# EAGLE board Main board (EAGLE 9.5.2)
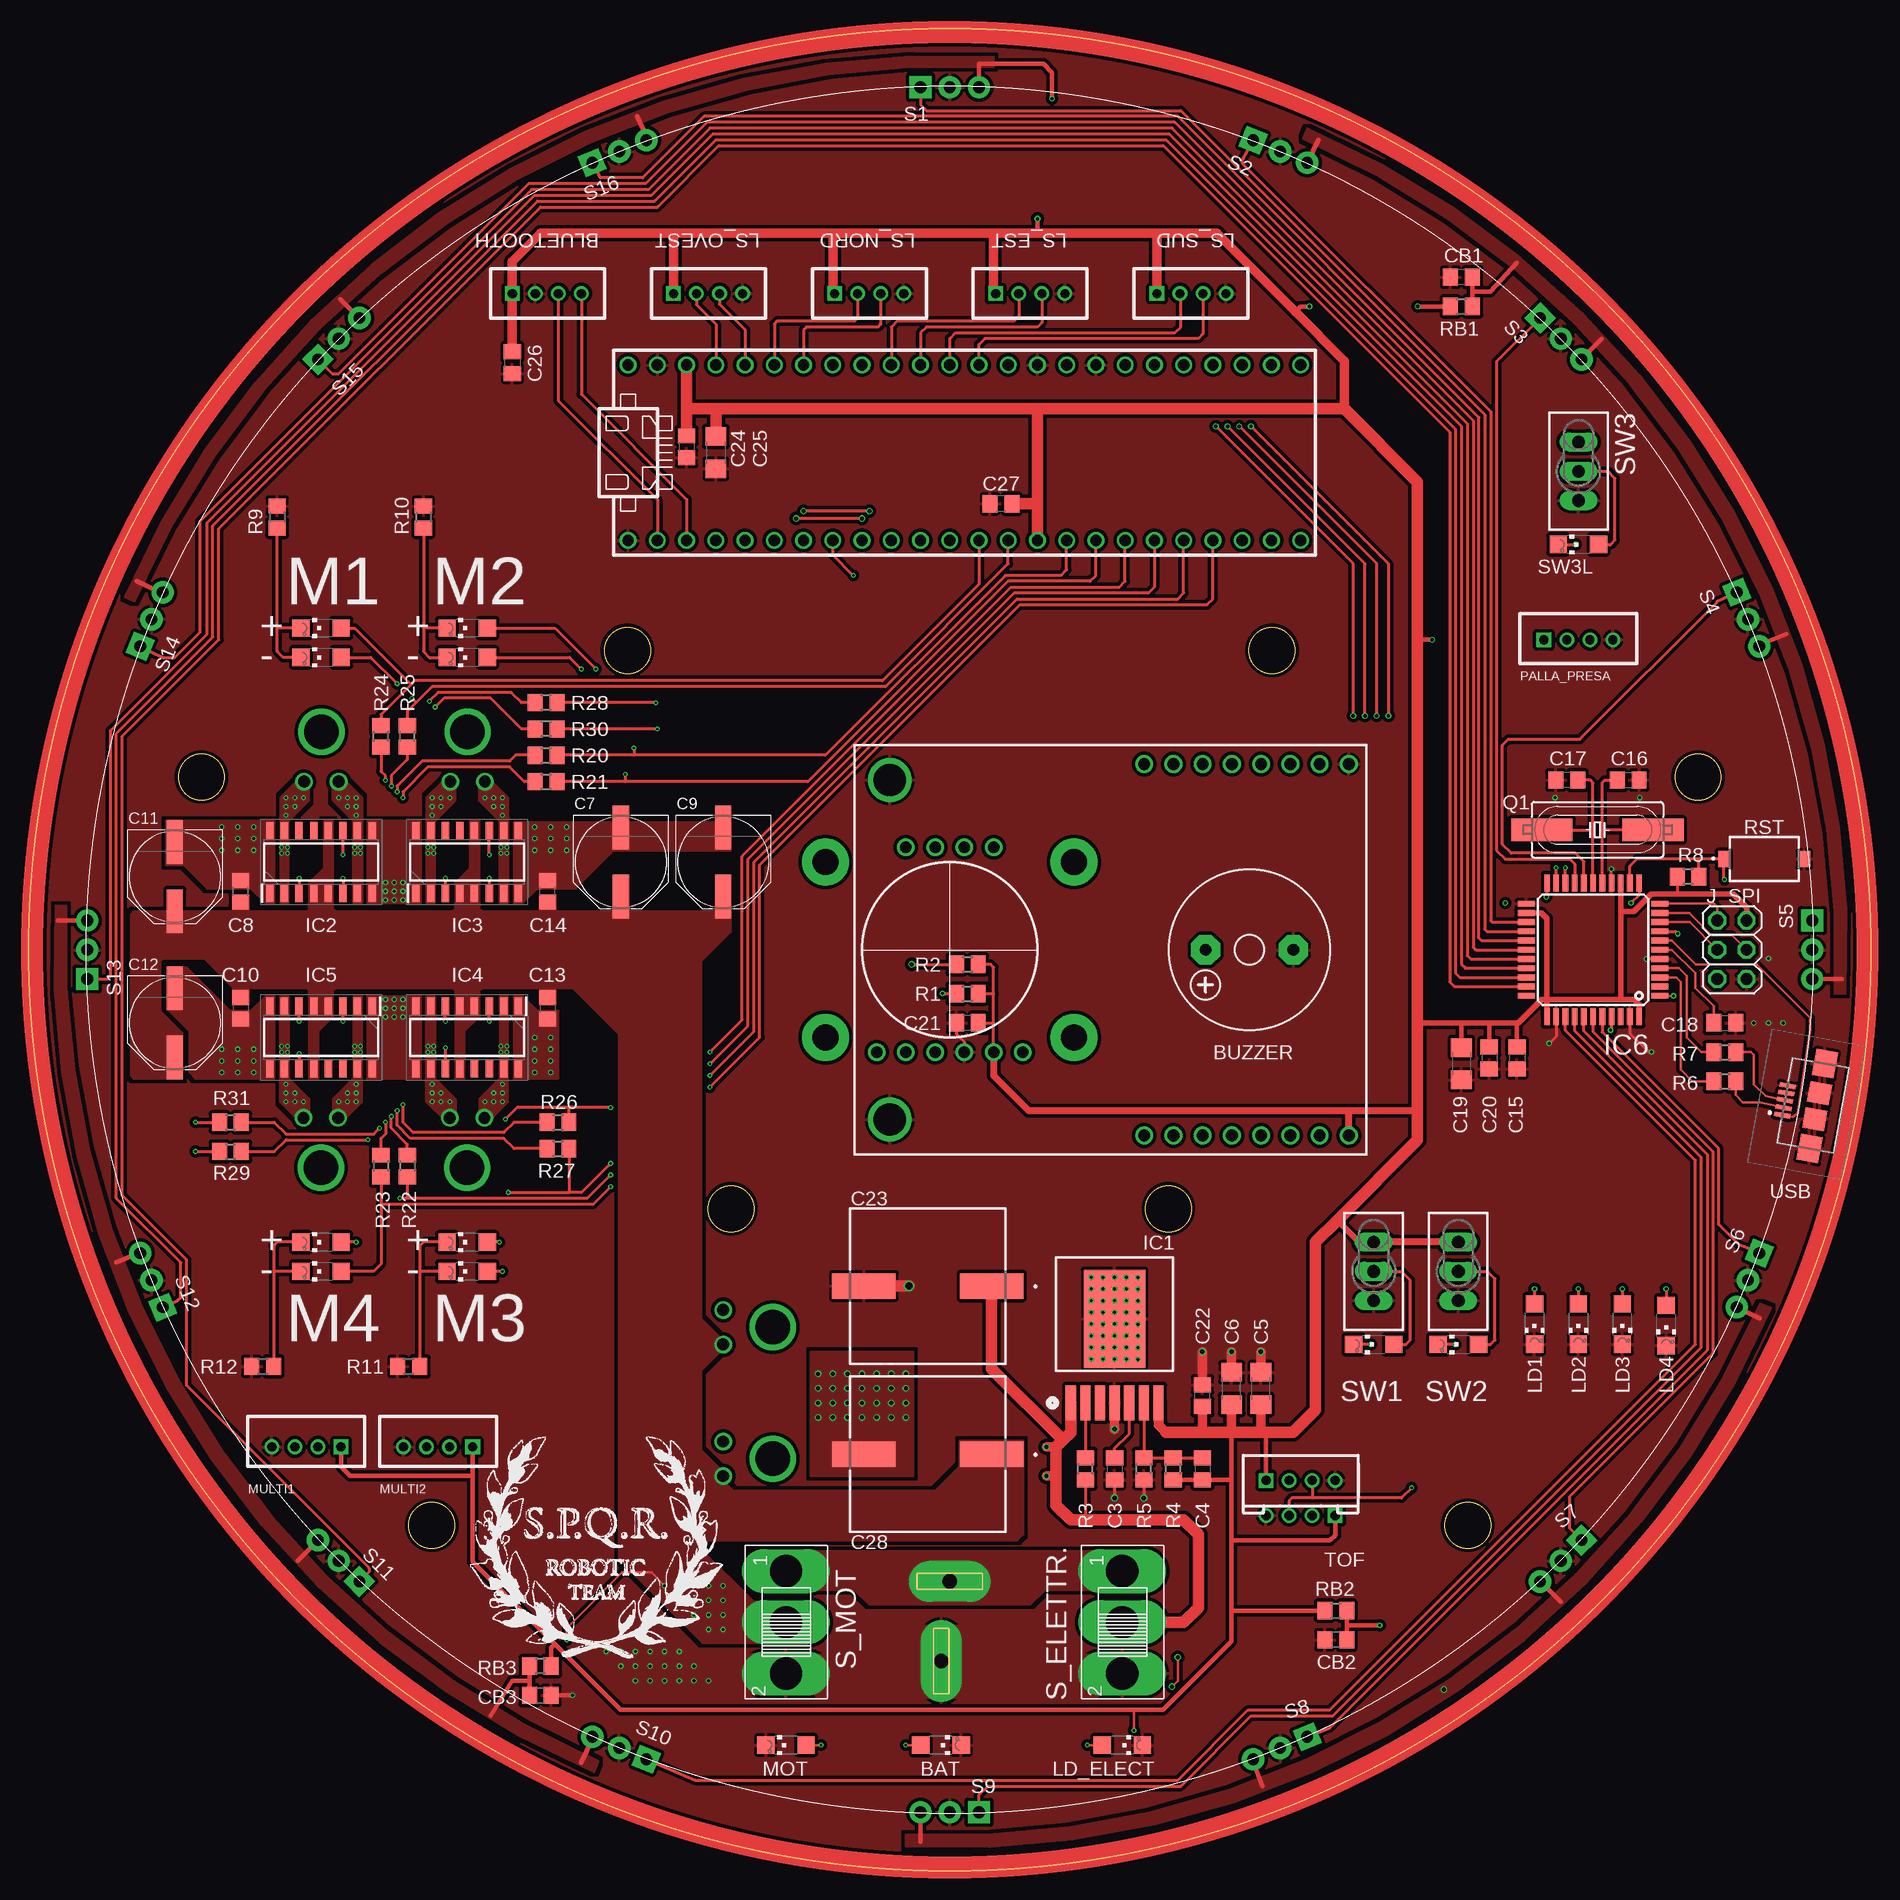
[diagram p1: board, top side]
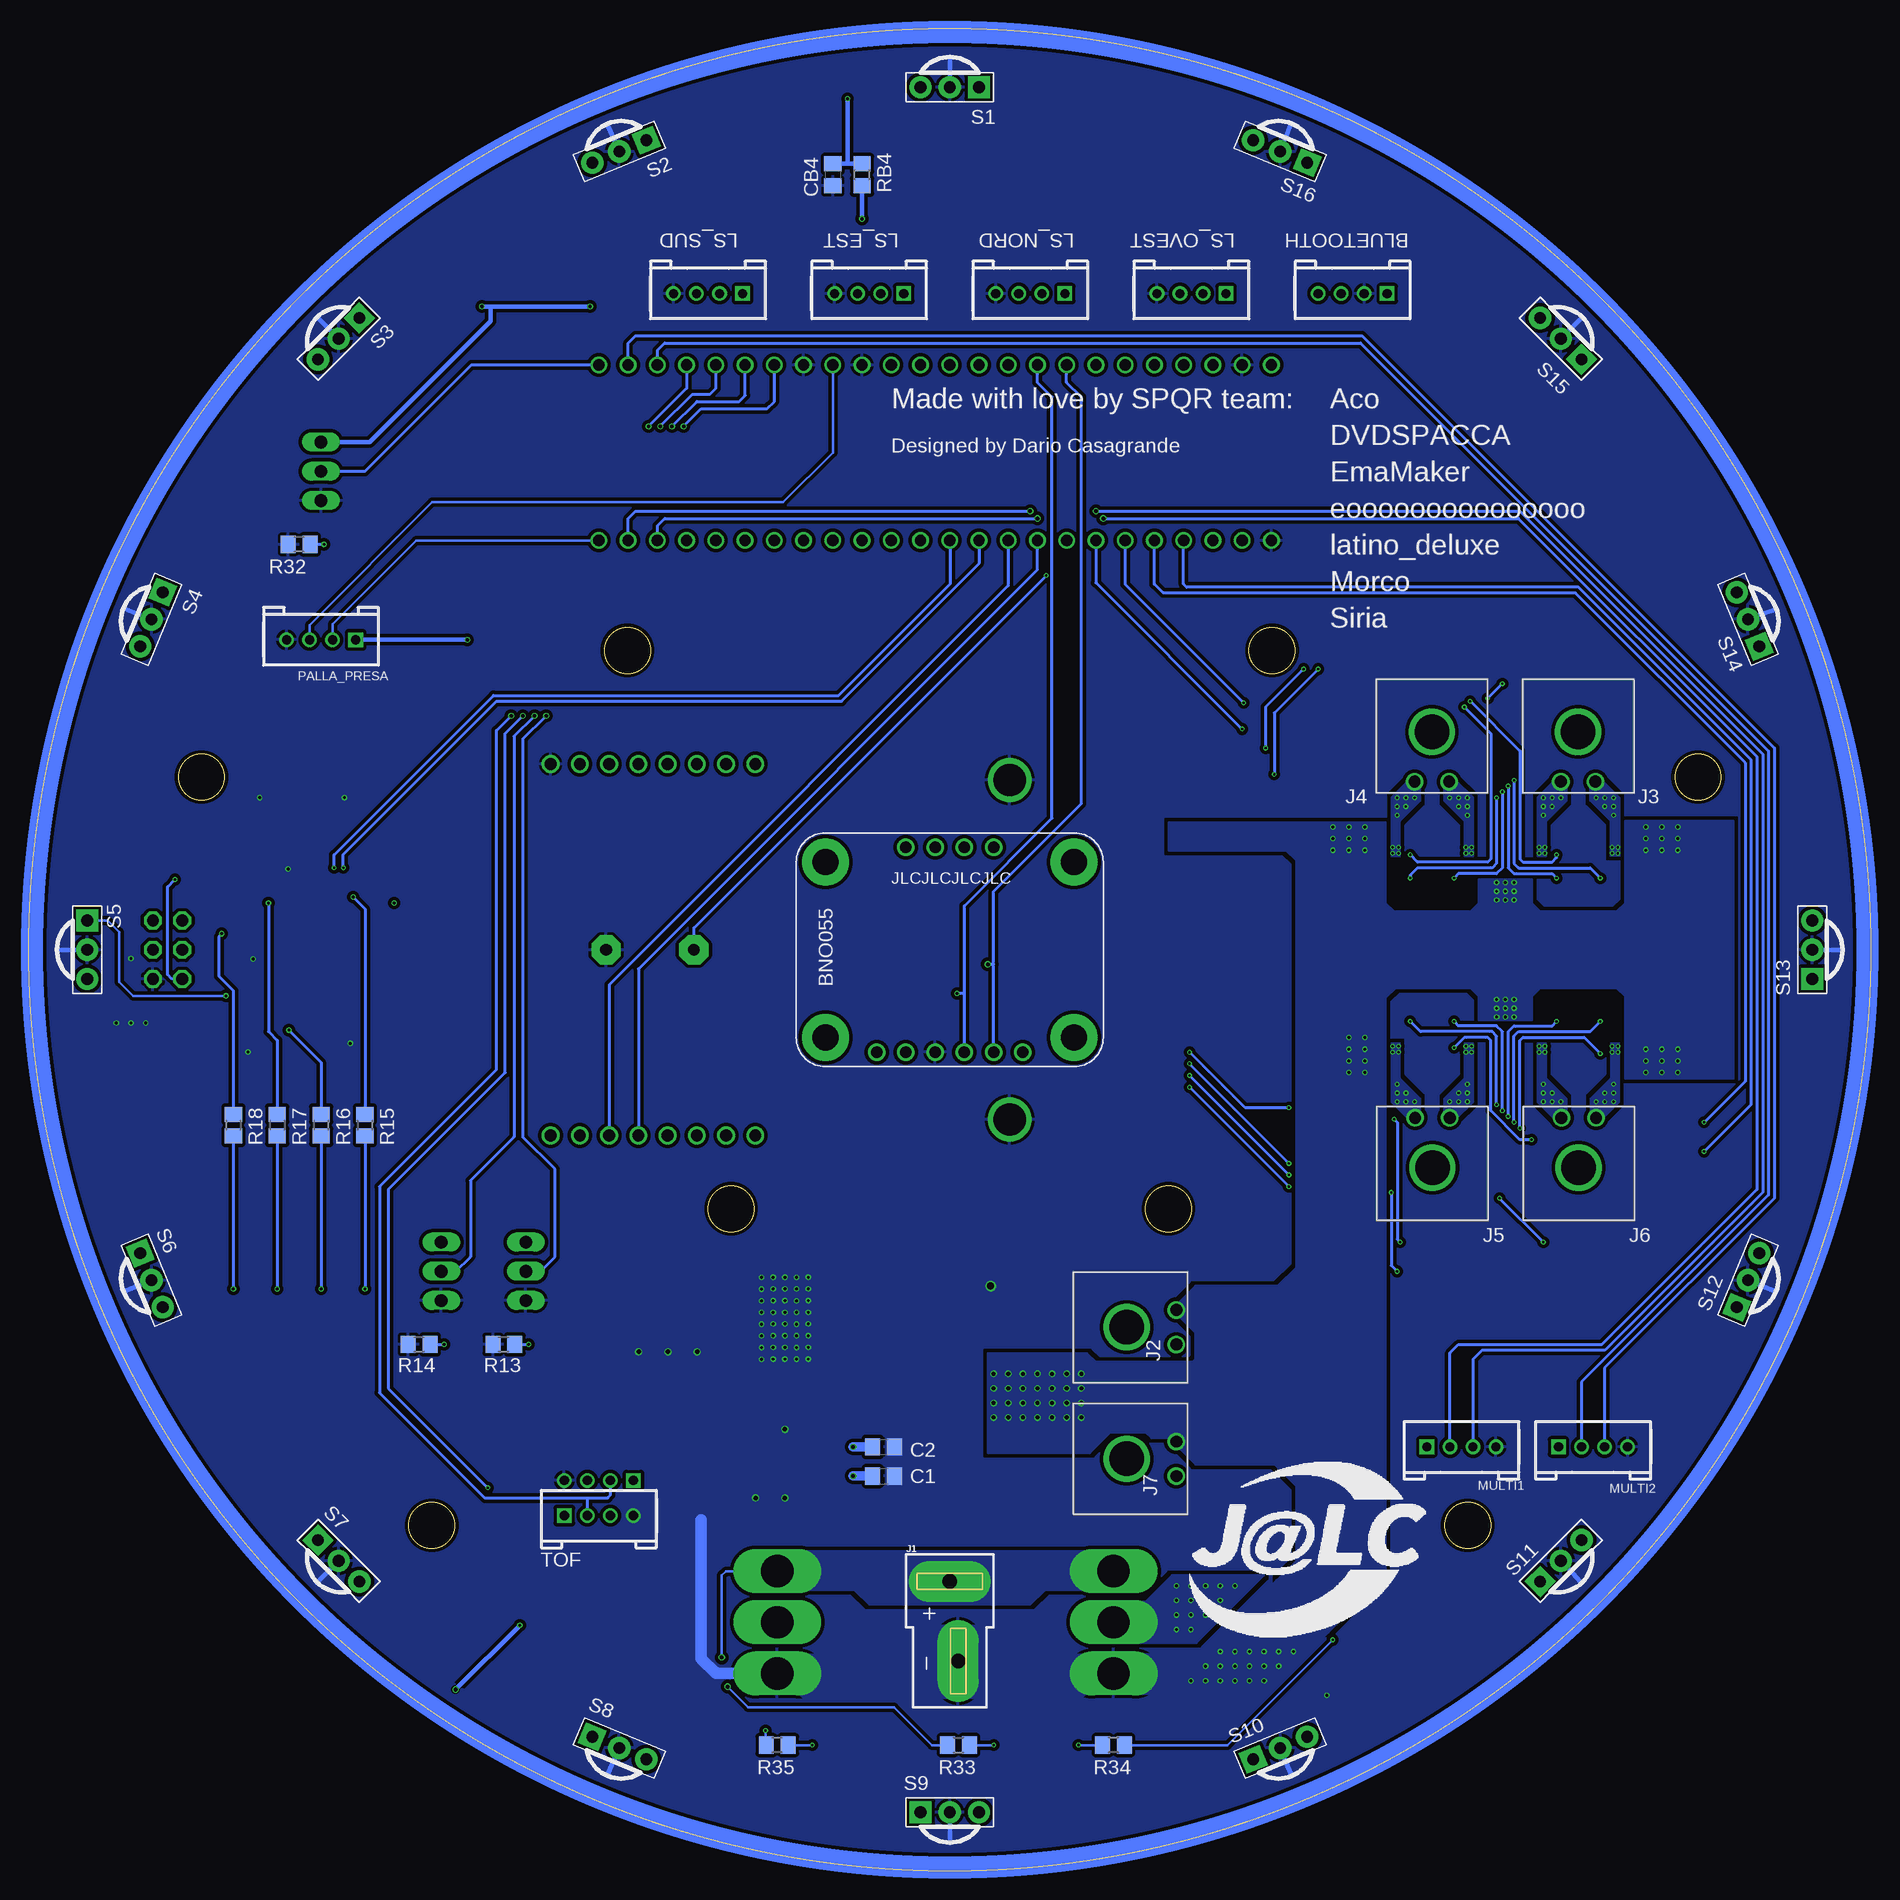
[diagram p2: board, bottom side, seen from below]

Size 160 x 160 mm. Coordinates in mm from the lower left corner, seen from the top.
Outline: circle at 80,80 radius 80
Outline: circle at 61,57.5 radius 2
Outline: circle at 99,57.5 radius 2
Outline: circle at 52,106 radius 2
Outline: circle at 108,106 radius 2
Outline: circle at 125,30 radius 2
Outline: circle at 35,30 radius 2
Outline: circle at 15,95 radius 2
Outline: circle at 145,95 radius 2
Copper layers (1*16): Top 0.035mm / dielectric 0.2mm / Bottom 0.035mm
Design rules "JLCPCB - 2 layers": minimum track width 3.5mil, minimum drill 0.2mm, track to track 3.5mil, track to pad 5mil, pad to pad 5mil, via to via 5mil, smd to smd 0mil, copper to edge 0.1mm, drill to drill 5mil, minimum pad ring 4mil, minimum via ring 4mil, stop-mask expansion 3mil, vias tented up to drill 100mil, thermal gap 10mil
Net classes: 1 Power: width 0.305 mm, clearance 0.305 mm; 2 +5V/1: width 0.61 mm, drill 0.406 mm, clearance 0.457 mm

## Footprints (pad centres in the part's own frame; a part is rotated, then mirrored left to right if it is on the bottom)
2.0_1X4 = drill 0.8 pad 1.27 square: 1 -3,0 | drill 0.8 pad 1.27: 2 -1,0; 3 1,0; 4 3,0
CHIPLED_1206 = smd 1.5 x 1.5: A 0,-1.75; C 0,1.75
F/CM12P = drill 1.016 pad 2.54 octagon: + 3.81,0; - -3.81,0
C0805 = smd 1.3 x 1.5: 1 -0.95,0; 2 0.95,0
C1206 = smd 1.6 x 1.8: 1 -1.4,0; 2 1.4,0
PANASONIC_E = smd 3.8 x 1.4: + 3,0; - -3,0
FKV(H13) = smd 5.5 x 2.2: 1 -5.55,0; 2 5.55,0
NDW0007A = smd 0.89 x 3.06: 1 -3.81,0; 2 -2.54,0; 3 -1.27,0; 4 0,0; 5 1.27,0; 6 2.54,0; 7 3.81,0 | smd 5.35 x 8.54: 8 0,7.305
SOIC127P600X175-16N = smd 1.525 x 0.65: 1 -2.712,4.445; 2 -2.712,3.175; 3 -2.712,1.905; 4 -2.712,0.635; 5 -2.712,-0.635; 6 -2.712,-1.905; 7 -2.712,-3.175; 8 -2.712,-4.445; 9 2.712,-4.445; 10 2.712,-3.175; 11 2.712,-1.905; 12 2.712,-0.635; 13 2.712,0.635; 14 2.712,1.905; 15 2.712,3.175; 16 2.712,4.445
TQFP44 = smd 1.5 x 0.5: 1 -5.8,4; 2 -5.8,3.2; 3 -5.8,2.4; 4 -5.8,1.6; 5 -5.8,0.8; 6 -5.8,0; 7 -5.8,-0.8; 8 -5.8,-1.6; 9 -5.8,-2.4; 10 -5.8,-3.2; 11 -5.8,-4; 23 5.8,-4; 24 5.8,-3.2; 25 5.8,-2.4; 26 5.8,-1.6; 27 5.8,-0.8; 28 5.8,0; 29 5.8,0.8; 30 5.8,1.6; 31 5.8,2.4; 32 5.8,3.2; 33 5.8,4 | smd 0.5 x 1.5: 12 -4,-5.8; 13 -3.2,-5.8; 14 -2.4,-5.8; 15 -1.6,-5.8; 16 -0.8,-5.8; 17 0,-5.8; 18 0.8,-5.8; 19 1.6,-5.8; 20 2.4,-5.8; 21 3.2,-5.8; 22 4,-5.8; 34 4,5.8; 35 3.2,5.8; 36 2.4,5.8; 37 1.6,5.8; 38 0.8,5.8; 39 0,5.8; 40 -0.8,5.8; 41 -1.6,5.8; 42 -2.4,5.8; 43 -3.2,5.8; 44 -4,5.8
DEANS = drill 1.27 pad 3.556 long: + 0,0; - 0.737,-6.921
43650-0200 = drill 1.02 pad 1.52: 1 0,0; 2 -3,0 | drill 3 pad 3: 3 -1.5,-4.32
2X03 = drill 1.016 octagon: 1 -2.54,-1.27; 2 -2.54,1.27; 3 0,-1.27; 4 0,1.27; 5 2.54,-1.27; 6 2.54,1.27
HC49UP = smd 5.334 x 1.93: 1 -4.826,0; 2 4.826,0
R0805 = smd 1.3 x 1.5: 1 -0.95,0; 2 0.95,0
KSR = smd 1 x 1.4: 1 -3.5,0; 2 3.5,0
PNA460XM = drill 1.016 pad 1.93 square: 1 -2.54,0 | drill 1.016 pad 1.93: 2 0,0; 3 2.54,0
255SB = drill 2.8 pad 3.048 long: 1 2.667,3.556; 2 7.112,3.556; 3 11.557,3.556
TL3XPO = drill 1.1 pad 1.422 long: 1 -2.54,0; 2 0,0; 3 2.54,0
TEENSY_3.5/3.6 = drill 0.965: 0/RX -25.4,-7.62; 1/TX -22.86,-7.62; 2 -20.32,-7.62; 3/CANTX -17.78,-7.62; 3V3 7.62,-7.62; 3V3_LO -22.86,7.62; 4/CANRX -15.24,-7.62; 5 -12.7,-7.62; 6 -10.16,-7.62; 7 -7.62,-7.62; 8 -5.08,-7.62; 9/CS -2.54,-7.62; 10/CS 0,-7.62; 11/MOSI 2.54,-7.62; 12/MISO 5.08,-7.62; 13/SCK 5.08,7.62; 14/A0 2.54,7.62; 15/A1 0,7.62; 16/A2 -2.54,7.62; 17/A3 -5.08,7.62; 18/A4/SDA -7.62,7.62; 19/A5/SCL -10.16,7.62; 20/A6 -12.7,7.62; 21/A7 -15.24,7.62; 21/DAC0 12.7,7.62; 22/A8 -17.78,7.62; 23/A9 -20.32,7.62; 24 10.16,-7.62; 25 12.7,-7.62; 26 15.24,-7.62; 27 17.78,-7.62; 28 20.32,-7.62; 29 22.86,-7.62; 30 25.4,-7.62; 31/A12 27.94,-7.62; 32/A13 30.48,-7.62; 33/A14 30.48,7.62; 34/A15 27.94,7.62; 35/A16 25.4,7.62; 36/A17 22.86,7.62; 37/A18 20.32,7.62; 38/A19 17.78,7.62; 39/A20 15.24,7.62; A22/DAC1 10.16,7.62; AGND -25.4,7.62; GND -27.94,-7.62; GND2 7.62,7.62; VIN -27.94,7.62
OPENMV_H7 = drill 1.016: 3V3 1.651,1.524; BOOT 33.909,16.764; GND 33.909,1.524; P0 1.651,19.304; P1 1.651,16.764; P2 1.651,14.224; P3 1.651,11.684; P4 1.651,9.144; P5 1.651,6.604; P6 1.651,4.064; P7 33.909,6.604; P8 33.909,9.144; P9 33.909,11.684; RST 33.909,19.304; SYNC 33.909,14.224; VIN 33.909,4.064 | drill 2.794 pad 3.81: PAD1 3.048,41.402 | drill 2.794: PAD2 32.512,41.402
BNO055 = drill 1: 3V3 9.525,1.27; ADR 17.145,19.05; GND 12.065,1.27; INT 14.605,19.05; PS0 9.525,19.05; PS1 12.065,19.05; RST 19.685,1.27; SCL 17.145,1.27; SDA 14.605,1.27; VIN 6.985,1.27 | drill 2.286 pad 4.064: PAD@1 2.54,17.78; PAD@2 24.13,17.78; PAD@3 2.54,2.54; PAD@4 24.13,2.54
101041110001LF = smd 0.4 x 1.4: 1 -1.3,5; 2 -0.65,5; 3 0,5; 4 0.65,5; 5 1.3,5 | smd 2.3 x 1.9: 6 -3.75,2.15; 7 3.75,2.15 | smd 1.8 x 1.9: 8 -1.15,2.15; 9 1.15,2.15

## Placement (x,y rotation side)
BALL  TWIG_2.0  [2.0_1X4]  134.61,106.92 180 bottom
BAT  [CHIPLED_1206]  79.24,10.91 270 top
BLUETOOTH  TWIG_2.0  [2.0_1X4]  45,137 180 bottom
BUZZER  F/CM12P  [F/CM12P]  106.03,80 180 top
C1  100n  [C0805]  85.75,34.28 0 bottom
C2  100n  [C0805]  85.75,36.82 0 bottom
C3  22n  [C0805]  94.32,34.91 270 top
C4  22n  [C0805]  101.94,34.91 270 top
C5  100u  [C1206]  107.02,41.9 90 top
C6  100u  [C1206]  104.48,41.9 90 top
C7  1OOu  [PANASONIC_E]  51.42,87.62 270 top
C8  1u  [C0805]  18.41,85.08 90 top
C9  100u  [PANASONIC_E]  60.31,87.62 270 top
C10  1u  [C0805]  18.41,74.92 270 top
C11  100u  [PANASONIC_E]  12.69,86.35 270 top
C12  100u  [PANASONIC_E]  12.69,73.65 270 top
C13  1u  [C0805]  45.08,74.92 270 top
C14  1u  [C0805]  45.08,85.08 90 top
C15  1u  [C0805]  129.28,70.6 270 top
C16  1u  [C0805]  138.93,94.73 0 top
C17  1u  [C0805]  133.59,94.73 180 top
C18  1u  [C0805]  147.31,73.65 0 top
C19  1u  [C1206]  124.45,70.09 270 top
C20  1u  [C0805]  126.86,70.6 270 top
C21  1u  [C0805]  81.52,73.65 180 top
C22  100n  [C0805]  101.94,41.27 90 top
C23  EEV-FK1C152Q  [FKV(H13)]  78.09,50.79 180 top
C24  100n  [C0805]  57.14,123.69 270 top
C25  100n  [C1206]  59.68,123.18 270 top
C26  1u  [C0805]  42,131 270 top
C27  100n  [C0805]  84.44,118.73 180 top
C28  EEV-FK1C152Q  [FKV(H13)]  78.09,36.19 180 top
CB1  0.1uF  [C0805]  124.45,138.42 180 top
CB2  0.1uF  [C0805]  113.53,20.06 180 top
CB3  0.1uF  [C0805]  44.44,15.23 0 top
CB4  0.1uF  [C0805]  90.16,147.31 270 bottom
IC1  LMZ14202TZE-ADJ_NOPB  [NDW0007A]  94.32,40.63 0 top
IC2  VNH7070ASTR  [SOIC127P600X175-16N]  25.39,87.62 90 top
IC3  VNH7070ASTR  [SOIC127P600X175-16N]  38.09,87.62 90 top
IC4  VNH7070ASTR  [SOIC127P600X175-16N]  38.09,72.38 270 top
IC5  VNH7070ASTR  [SOIC127P600X175-16N]  25.39,72.38 270 top
IC6  ATMEGA32U4-AU  [TQFP44]  135.88,80 180 top
J1  [DEANS]  80,25.14 0 bottom
J2  43650-0201  [43650-0200]  60.31,45.71 270 bottom
J3  43650-0201  [43650-0200]  26.91,94.61 180 bottom
J4  43650-0201  [43650-0200]  39.61,94.61 180 bottom
J5  43650-0201  [43650-0200]  36.57,65.39 0 bottom
J6  43650-0201  [43650-0200]  23.87,65.39 0 bottom
J7  43650-0201  [43650-0200]  60.31,34.28 270 bottom
J_SPI  [2X03]  147.94,80 270 top
LD1  [CHIPLED_1206]  130.8,47.49 180 top
LD2  [CHIPLED_1206]  134.61,47.49 180 top
LD3  [CHIPLED_1206]  138.42,47.49 180 top
LD4  [CHIPLED_1206]  142.23,47.36 180 top
LD_ELECT  [CHIPLED_1206]  94.99,10.91 270 top
LS_EST  TWIG_2.0  [2.0_1X4]  87,137 180 bottom
LS_NORD  TWIG_2.0  [2.0_1X4]  73,137 180 bottom
LS_OVEST  TWIG_2.0  [2.0_1X4]  59,137 180 bottom
LS_SUD  TWIG_2.0  [2.0_1X4]  101,137 180 bottom
M1+  [CHIPLED_1206]  25.39,107.94 90 top
M1-  [CHIPLED_1206]  25.39,105.4 90 top
M2+  [CHIPLED_1206]  38.09,107.94 90 top
M2-  [CHIPLED_1206]  38.09,105.4 90 top
M3+  [CHIPLED_1206]  38.09,54.6 90 top
M3-  [CHIPLED_1206]  38.09,52.06 90 top
M4+  [CHIPLED_1206]  25.39,54.6 90 top
M4-  [CHIPLED_1206]  25.39,52.06 90 top
MOT  [CHIPLED_1206]  65.78,10.91 90 top
MULTI1  TWIG_2.0  [2.0_1X4]  35.55,36.82 0 bottom
MULTI2  TWIG_2.0  [2.0_1X4]  24.12,36.82 0 bottom
Q1  [HC49UP]  136.26,90.41 180 top
R1  10k  [R0805]  81.52,76.19 0 top
R2  10k  [R0805]  81.52,78.73 0 top
R3  61,9k  [R0805]  91.78,34.91 90 top
R4  3,32k  [R0805]  99.4,34.91 90 top
R5  1,07k  [R0805]  96.86,34.91 90 top
R6  [R0805]  147.31,68.57 0 top
R7  [R0805]  147.31,71.11 0 top
R8  [R0805]  144.13,86.35 180 top
R9  [R0805]  21.58,117.59 270 top
R10  [R0805]  34.28,117.59 270 top
R11  [R0805]  33.01,43.8 0 top
R12  [R0805]  20.31,43.8 0 top
R13  [R0805]  118.73,45.71 180 bottom
R14  [R0805]  126.09,45.71 180 bottom
R15  [R0805]  130.8,64.76 270 bottom
R16  [R0805]  134.61,64.76 270 bottom
R17  [R0805]  138.42,64.76 270 bottom
R18  [R0805]  142.23,64.76 270 bottom
R20  [R0805]  44.95,96.89 0 top
R21  [R0805]  44.95,94.61 0 top
R22  [R0805]  32.88,61.2 270 top
R23  [R0805]  30.6,61.2 270 top
R24  [R0805]  30.6,98.54 90 top
R25  [R0805]  32.88,98.54 90 top
R26  [R0805]  45.96,65.01 0 top
R27  [R0805]  45.96,62.73 0 top
R28  [R0805]  44.95,101.46 180 top
R29  [R0805]  17.52,62.47 0 top
R30  [R0805]  44.95,99.18 180 top
R31  [R0805]  17.52,65.01 0 top
R32  [R0805]  136.51,115.21 180 bottom
R33  [R0805]  79.24,10.91 0 bottom
R34  [R0805]  65.78,10.91 180 bottom
R35  [R0805]  94.99,10.91 180 bottom
RB1  22  [R0805]  124.45,135.88 0 top
RB2  22  [R0805]  113.53,22.6 0 top
RB3  22  [R0805]  44.44,17.77 180 top
RB4  22  [R0805]  87.62,147.31 90 bottom
RST  KSR231GLFS  [KSR]  150.74,87.87 0 top
S1  PNA460XM  [PNA460XM]  80,154.93 180 bottom
S2  PNA460XM  [PNA460XM]  108.7,149.34 202.5 bottom
S3  PNA460XM  [PNA460XM]  133.09,133.09 225 bottom
S4  PNA460XM  [PNA460XM]  149.34,108.7 247.5 bottom
S5  PNA460XM  [PNA460XM]  154.93,80 270 bottom
S6  PNA460XM  [PNA460XM]  149.34,51.3 292.5 bottom
S7  PNA460XM  [PNA460XM]  133.09,26.91 315 bottom
S8  PNA460XM  [PNA460XM]  108.7,10.66 337.5 bottom
S9  PNA460XM  [PNA460XM]  80,5.07 0 bottom
S10  PNA460XM  [PNA460XM]  51.3,10.66 22.5 bottom
S11  PNA460XM  [PNA460XM]  26.91,26.91 45 bottom
S12  PNA460XM  [PNA460XM]  10.66,51.3 67.5 bottom
S13  PNA460XM  [PNA460XM]  5.07,80 90 bottom
S14  PNA460XM  [PNA460XM]  10.66,108.7 112.5 bottom
S15  PNA460XM  [PNA460XM]  26.91,133.09 135 bottom
S16  PNA460XM  [PNA460XM]  51.3,149.34 157.5 bottom
S_ELETTR.  [255SB]  91.43,28.69 270 top
S_MOT  [255SB]  62.22,28.69 270 top
SW1  TL38PO  [TL3XPO]  116.83,52.06 270 top
SW1L  [CHIPLED_1206]  116.83,45.71 90 top
SW2  TL38PO  [TL3XPO]  124.18,52.06 270 top
SW2L  [CHIPLED_1206]  124.18,45.71 90 top
SW3  TL38PO  [TL3XPO]  134.61,121.56 270 top
SW3L  [CHIPLED_1206]  134.61,115.21 90 top
TOF  TWIG_2.0  [2.0_1X4]  110.48,30.85 0 bottom
TOF_TOP  TWIG_2.0  [2.0_1X4]  110.48,33.9 0 top
U$1  TEENSY_3.5/3.6  [TEENSY_3.5/3.6]  80,123.18 0 top
U$2  OPENMV_H7  [OPENMV_H7]  116.19,62.22 90 top
U$4  BNO055  [BNO055]  93.34,69.84 0 bottom
USB  10104111-0001LF  [101041110001LF]  157.47,66.03 79.7 top

## Tracks (layer width: path | path; a pad name or v marks a point on that pad's centre or on a via)
+3V3  (via drill 0.2, 0.3)
  Top 0.203: 96,13.96 v96,12.18
  Top 0.254: U$4.3V3 83.81,73.65 | 83.81,73.65 83.81,76.19 | 83.81,76.19 83.81,78.48 83.56,78.73 R2.2 | R1.2 83.81,76.19 | C21.1 83.81,73.65 | R8.2 143.19,84.89 143.25,84.83
  Top 0.406: 138.28,75.69 138.29,75.68 | 45.71,19.67 51.42,13.96 96,13.96 98.51,13.96 104.48,19.93 104.48,22.6 | RB1.1 v120.64,135.88 | C19.1 124.45,73.65 | C15.1 129.28,73.65 | v111.24,135.88 110.48,135.88 110.02,135.42 | v87.62,143.5 87.62,142.23 | C20.1 126.86,73.52 126.74,73.65 | MULTI2.1 27.12,35.09 27.93,34.28 38.55,34.28 | MULTI1.1 38.55,34.28 | 38.55,34.28 38.55,26.84 45.71,19.67 | RB3.1 45.39,19.35 45.71,19.67 | v121.91,106.92 120.64,106.92 | TOF.1 113.48,29.15 113.02,28.69 104.48,28.69 | 104.48,28.69 104.48,34.03 | 104.48,34.03 104.48,38.09 | 104.48,22.6 104.48,28.69 | RB2.1 104.48,22.6 | R4.1 C4.2 104.42,33.97 104.48,34.03 | TOF_TOP.1 107.48,38.04 107.43,38.09
  Top 0.457: IC6.24 131.41,83.2 131.88,82.73 131.88,75.68 | 131.88,75.68 IC6.34 | IC6.44 139.88,75.24 139.44,75.68 138.29,75.68 131.88,75.68 | IC6.14 138.28,83.3 | 138.28,83.3 138.28,75.69 | J_SPI.2 149.22,83.68 148.07,84.83 143.25,84.83 140.96,84.83 139.44,83.3 138.28,83.3 | 131.88,75.68 131.44,75.68 129.4,73.65 129.28,73.65 126.74,73.65 124.45,73.65 120.64,73.65
  Top 0.508: SW1.1 115.56,54.6 113.66,56.5
  Top 0.61: U$4.3V3 83.81,69.08 86.86,66.03 114.67,66.03 | 114.67,66.03 120.64,66.03 | U$2.3V3 114.67,66.03 | SW2.1 SW1.1
  Top 0.813: C22.1 101.94,38.09 | C6.1 104.48,38.09 | C5.1 107.02,38.09 | C26.1 BLUETOOTH.1 42,139.79 44.44,142.23 55.87,142.23 | 114.29,126.99 114.29,131.15 110.02,135.42 103.21,142.23 97.78,142.23 | 55.87,142.23 69.84,142.23 | 69.84,142.23 83.81,142.23 | 83.81,142.23 87.62,142.23 97.78,142.23 | LS_NORD.1 69.84,137.16 69.84,142.23 | LS_EST.1 83.81,137.19 83.81,142.23 | LS_SUD.1 98,142.01 97.78,142.23 | LS_OVEST.1 56,142.1 55.87,142.23
  Top 0.889: IC1.7 98.13,38.73 98.77,38.09
  Top 1.016: 98.77,38.09 101.94,38.09 104.48,38.09 107.02,38.09 107.43,38.09 109.83,38.09 111.75,40.01 111.75,54.6 113.66,56.5 120.64,63.49 120.64,66.03 120.64,73.65 120.64,106.92 120.64,120.64 114.29,126.99 87.62,126.99 | U$1.3V3_LO 57.14,126.99 | 57.14,126.99 59.68,126.99 | 59.68,126.99 87.62,126.99 | U$1.3V3 87.62,118.73 | 87.62,118.73 87.62,126.99 | C24.1 57.14,126.99 | C25.1 59.68,126.99 | C27.1 87.62,118.73
  Bottom 0.203: v96,12.18 96,10.98 R35.2
  Bottom 0.406: RB4.1 v87.62,143.5 | v111.24,135.88 119.88,135.88 | 119.88,135.88 v120.64,135.88 | 119.88,135.88 119.88,134.61 130.39,124.1 SW3.1 | BALL.1 v121.91,106.92
+12V  (via drill 0.35)
  Top 0.254: R3.1 91.78,30.63 91.94,30.47
  Top 0.813: v88.38,36.82 89.24,36.82 | v88.38,34.28 89.24,34.28
  Top 1.016: 89.83,37.41 89.24,36.82 89.24,34.28 89.24,31.74 90.51,30.47 91.94,30.47 100.32,30.47 101.59,29.2 101.59,22.85 100.32,21.58 S_ELETTR..2 | 89.83,37.41 90.51,38.09 IC1.1 | C23.1 83.64,43.59 89.83,37.41
  Bottom 0.813: C2.1 v88.38,36.82 | C1.1 v88.38,34.28
A/TRIG  (via drill 0.3)
  Top 0.254: v106.16,125.47 118.1,113.53 v118.1,100.32
  Bottom 0.254: v118.1,100.32 119.37,99.05 119.37,69.59 129.53,59.43 129.53,41.52 120.39,32.38 111.5,32.38 | U$1.36/A17 102.86,128.77 v106.16,125.47 | TOF_TOP.2 109.46,33.88 109.46,32.63 109.72,32.38 111.5,32.38 | TOF.2 111.48,32.36 111.5,32.38
BALL_IN
  Bottom 0.203: BALL.2 133.61,108.31 126.35,115.56 U$1.32/A13
BALL_OUT
  Bottom 0.203: BALL.3 135.61,108.21 124.96,118.86 94.48,118.86 90.16,123.18 U$1.A22/DAC1
BUZZ  (via drill 0.2)
  Top 0.254: v71.62,112.51 69.84,114.29 U$1.6
  Bottom 0.254: BUZZER.+ 102.22,81.91 v71.62,112.51
E_EST
  Top 0.254: LS_EST.3 88,134.48 87.62,134.1 77.97,134.1 77.46,133.59 U$1.16/A2
E_INT
  Top 0.254: LS_EST.2 86,135.02 85.59,134.61 75.43,134.61 74.92,134.1 U$1.17/A3
ECHO  (via drill 0.2, 0.3)
  Top 0.254: v117.08,100.32 117.08,113.53 v105.15,125.47 | v120.13,33.26 119.24,32.38 111.5,32.38 | 111.5,32.38 109.72,32.38 109.48,32.14 TOF.3 | TOF_TOP.3 111.5,33.88 111.5,32.38
  Bottom 0.254: v117.08,100.32 118.61,98.8 118.61,69.33 128.77,59.17 128.77,41.9 v120.13,33.26 | U$1.37/A18 100.32,128.77 100.83,128.26 102.35,128.26 v105.15,125.47
GND  (via drill 0.25, 0.4, 0.6)
  Top 0.254: C3.2 v94.32,32.38 | R5.1 v96.86,32.38 | C21.2 80.57,72.69 81.27,72 U$4.GND | IC6.15 v137.48,87.01 | v137.48,87.01 | IC6.35 132.68,72.48 v132.07,71.87 | IC6.43 139.08,72.74 140.71,71.11 v140.96,71.11 | IC6.5 140.52,79.2 v140.5,79.19
  Top 0.406: CB3.2 v47.23,15.23
  Top 0.813: IC1.4 v94.32,38.34 | C22.2 v101.94,45.08 | C6.2 v104.48,45.08 | C5.2 v107.02,45.08
  Top 1.016: C23.2 v76.44,50.79
  Bottom 0.406: S5.2 157.47,80 | 151.63,109.59 149.41,108.7 S4.2 | S3.2 134.86,134.86 | 109.72,151.63 108.7,149.39 S2.2 | S1.2 80,157.47 | S16.2 51.3,149.41 50.41,151.63 | S15.2 25.14,134.86 | S14.2 10.5,108.86 8.5,109.46 | S13.2 2.53,80 | S12.2 10.62,51.26 8.5,50.41 | S11.2 26.15,26.15 25.26,25.14 | S10.2 51.3,10.48 50.28,8.25 | S9.2 80,2.4 | S8.2 108.7,10.61 109.72,8.37 | S7.2 134.99,25.01 | S6.2 149.37,51.3 151.5,50.41
  Bottom 1.016: S_ELETTR..3 100.32,17.13 101.59,18.41 101.59,30.47
  other vias: 53.97,19.04 55.23,19.04 56.5,19.04 50.16,19.04 51.42,19.04 52.7,19.04 92.29,50.54 96.35,50.52 94.32,50.54 132.58,93.21 139.94,93.21 149.85,73.65 151.12,73.65 152.39,73.65 151.12,79.24 92.29,51.55 96.35,51.54 94.32,51.55 93.3,51.54 95.34,51.55 95.34,50.54 93.3,50.54 92.29,48.5 96.35,48.49 94.32,48.5 92.29,49.52 96.35,49.5 94.32,49.52 93.3,49.5 95.34,49.52 95.34,48.5 93.3,48.5 92.29,46.47 96.35,46.46 94.32,46.47 92.29,47.49 96.35,47.47 94.32,47.49 93.3,47.47 95.34,47.49 95.34,46.47 93.3,46.47 92.29,44.44 96.35,44.42 94.32,44.44 92.29,45.46 96.35,45.44 94.32,45.46 93.3,45.44 95.34,45.46 95.34,44.44 93.3,44.44 51.42,17.77 52.7,16.5 52.7,17.77 53.97,16.5 53.97,17.77 55.23,16.5 55.23,17.77 56.5,16.5 56.5,17.77 57.77,16.5 57.77,17.77 59.05,16.5
  pour Top (no thermals): 64.25,18.79 70.47,18.79 73.02,21.33 86.98,21.33 89.53,18.79 96.51,18.79 96.51,15.36 93.08,15.36 92.7,14.98 68.57,14.98 68.19,15.36 64.25,15.36
  pour Bottom (no thermals): 96.51,18.79 89.53,18.79 86.98,21.33 73.02,21.33 70.47,18.79 64.25,18.79 64.25,15.36 68.19,15.36 68.57,14.98 92.7,14.98 93.08,15.36 96.51,15.36
  pour Top (no thermals): 67.3,18.79 58.05,18.79 56.77,20.06 47.74,20.06 52.44,15.36 67.3,15.36
  pour Bottom (isolate 0.406, rank 2, no thermals): 70.19,53.33 110.83,53.33 110.83,29.2 70.19,29.2
  pour Bottom (no thermals): 67.3,15.36 67.3,18.79 58.05,18.79 51.62,25.21 47.11,20.69 52.44,15.36
  pour Bottom (no thermals): 80,157.98 80,156.96 arc-180 80,3.04 80,2.02 arc180
  pour Bottom (no thermals): 80,2.02 80,3.04 arc-180 80,156.96 80,157.98 arc180
  pour Top (isolate 0.305, rank 2): -2,80 arc-90 80,162 arc-90 162,80 arc-90 80,-2 arc-90
  pour Bottom (isolate 0.305, rank 2): -3,80 arc-90 80,163 arc-90 163,80 arc-90 80,-3 arc-90
INA_1  (via drill 0.2)
  Top 0.254: R24.1 30.6,95.49 30.98,95.11 v30.98,94.73 | v23.48,86.22 IC2.3
  Bottom 0.254: v30.98,94.73 30.98,87.49 30.6,87.11 24.37,87.11 v23.48,86.22
INA_2  (via drill 0.2)
  Top 0.254: R20.1 42.28,96.89 41.77,96.38 34.15,96.38 31.99,94.22 v31.99,93.72 | v36.19,86.22 IC3.3
  Bottom 0.254: v36.19,86.22 35.8,86.6 32.5,86.6 31.99,87.11 v31.99,93.72
INA_3  (via drill 0.2)
  Top 0.254: R26.1 42.15,65.01 41.27,64.12 33.39,64.12 32.5,65.01 v32.5,66.54 | v39.99,73.78 IC4.3
  Bottom 0.254: v39.99,73.78 39.11,72.89 32.88,72.89 32.5,72.51 v32.5,66.54
INA_4  (via drill 0.2)
  Top 0.254: R22.1 32.88,63.11 31.49,64.51 v31.49,65.52 | v27.3,73.78 IC5.3
  Bottom 0.254: v31.49,65.52 31.49,72.89 30.98,73.4 27.68,73.4 v27.3,73.78
INB_1  (via drill 0.2)
  Top 0.254: R25.1 32.88,96.51 31.49,95.11 v31.49,94.22 | v27.3,86.22 IC2.6
  Bottom 0.254: v31.49,94.22 31.49,87.11 30.98,86.6 27.68,86.6 v27.3,86.22
INB_2  (via drill 0.2)
  Top 0.254: R21.1 43.04,94.61 41.77,95.88 34.66,95.88 32.5,93.72 v32.5,93.21 | v39.99,86.22 IC3.6
  Bottom 0.254: v32.5,93.21 32.5,87.49 32.88,87.11 39.36,87.11 39.99,86.48 v39.99,86.22
INB_3  (via drill 0.2)
  Top 0.254: R27.1 42.15,62.73 41.27,63.62 33.14,63.62 31.99,64.76 v31.99,66.03 | v36.19,73.78 IC4.6
  Bottom 0.254: v31.99,66.03 31.99,72.89 32.5,73.4 35.8,73.4 v36.19,73.78
INB_4  (via drill 0.2)
  Top 0.254: R23.1 30.6,63.62 30.98,64 v30.98,65.01 | v23.48,73.78 IC5.6
  Bottom 0.254: v23.48,73.78 24.37,72.89 30.6,72.89 30.98,72.51 v30.98,65.01
LED1  (via drill 0.25)
  Top 0.254: IC6.22 131.88,84.64 v131.82,84.57
  Bottom 0.254: v131.82,84.57 130.8,83.56 R15.1
LED2  (via drill 0.25)
  Top 0.254: IC6.41 137.48,73.09 v137.4,73.02
  Bottom 0.254: v137.4,73.02 134.61,70.22 R16.1
LED3  (via drill 0.25)
  Top 0.254: IC6.12 139.88,84.76 v139.18,84.06
  Bottom 0.254: R17.1 138.42,72.13 139.18,72.89 v139.18,84.06
LED4  (via drill 0.25)
  Top 0.254: IC6.8 143.04,81.6 v143.25,81.4
  Bottom 0.254: v143.25,81.4 143.5,81.14 143.5,77.71 142.23,76.44 R18.1
M1_INA
  Top 0.254: U$1.11/MOSI 82.54,111.75 74.16,103.37 33.52,103.37 33.2,103.05 | M1+.A 28.31,107.94 33.2,103.05 | 33.2,103.05 30.6,100.45 R24.2
M1_INB  (via drill 0.2)
  Top 0.254: U$1.12/MISO 85.08,113.53 74.41,102.86 35.04,102.86 33.77,101.59 33.65,101.46 | M1-.A 29.71,105.4 v31.99,103.11 | 33.65,101.46 v33.26,101.84 | 33.65,101.46 32.88,100.7 R25.2
  Bottom 0.254: v33.26,101.84 v31.99,103.11
M1_OUTA  (via drill 0.2)
  other vias: 22.47,88.38 21.96,88.38 21.96,88.89 22.47,88.89 23.87,93.21 23.1,93.21 22.34,93.21 23.1,92.45 22.34,92.45 22.34,91.68
  pour Top (no thermals): 22.6,91.18 24.37,92.95 24.37,94.73 23.36,94.73 21.83,93.21 21.83,84.06 22.6,84.06
  pour Bottom (no thermals): 21.83,88.13 22.6,88.13 22.6,91.18 24.37,92.95 24.37,94.73 23.36,94.73 21.83,93.21
M1_OUTB  (via drill 0.2)
  other vias: 28.82,88.38 28.31,88.38 28.31,88.89 28.82,88.89 28.44,91.68 28.44,92.45 28.44,93.21 27.68,92.45 27.68,93.21 26.91,93.21
  pour Top (no thermals): 28.18,84.06 28.18,91.18 26.41,92.95 26.41,94.73 27.42,94.73 28.95,93.21 28.95,84.06
  pour Bottom (no thermals): 28.18,91.18 26.41,92.95 26.41,94.73 27.42,94.73 28.95,93.21 28.95,88.13 28.18,88.13
M1_PWM  (via drill 0.2)
  Top 0.254: v54.47,101.46 R28.1
  Bottom 0.254: U$1.4/CANRX 64.76,111.75 v54.47,101.46
M2_INA  (via drill 0.2)
  Top 0.254: U$1.24 90.16,113.02 89.65,112.51 84.83,112.51 69.2,96.89 52.57,96.89 | 52.57,96.89 R20.2 | M2+.A 45.71,107.94 v49.27,104.38 | v52.57,97.53 52.57,96.89
  Bottom 0.254: v49.27,104.38 52.57,101.08 v52.57,97.53
M2_INB  (via drill 0.2)
  Top 0.254: U$1.25 92.7,112.51 92.19,112 85.08,112 67.68,94.61 51.81,94.61 | 51.81,94.61 R21.2 | M2-.A 46.98,105.4 v48,104.38 | v51.81,95.24 51.81,94.61
  Bottom 0.254: v48,104.38 51.81,100.57 v51.81,95.24
M2_OUTA  (via drill 0.2)
  other vias: 34.66,88.38 35.17,88.38 35.17,88.89 34.66,88.89 36.57,93.21 35.8,93.21 35.04,93.21 35.8,92.45 35.04,92.45 35.04,91.68
  pour Top (no thermals): 35.3,91.18 37.07,92.95 37.07,94.73 36.06,94.73 34.53,93.21 34.53,84.06 35.3,84.06
  pour Bottom (no thermals): 34.53,93.21 36.06,94.73 37.07,94.73 37.07,92.95 35.3,91.18 35.3,88.13 34.53,88.13
M2_OUTB  (via drill 0.2)
  other vias: 41.52,88.38 41.01,88.38 41.01,88.89 41.52,88.89 41.14,91.68 41.14,92.45 41.14,93.21 40.38,92.45 40.38,93.21 39.61,93.21
  pour Top (no thermals): 40.88,84.06 40.88,91.18 39.11,92.95 39.11,94.73 40.12,94.73 41.65,93.21 41.65,84.06
  pour Bottom (no thermals): 39.11,94.73 40.12,94.73 41.65,93.21 41.65,88.13 40.88,88.13 40.88,91.18 39.11,92.95
M2_PWM  (via drill 0.2)
  Top 0.254: v54.6,99.18 R30.1
  Bottom 0.254: U$1.5 67.3,111.88 v54.6,99.18
M3_INA  (via drill 0.2)
  Top 0.254: U$1.26 95.24,112 94.73,111.5 85.33,111.5 61.97,88.13 61.97,73.9 v59.17,71.11 | v50.54,66.28 46.91,66.28 | R26.2 46.91,66.28 | 46.91,66.28 42.41,66.28 v41.39,65.27 | v40.88,54.6 M3+.A
  Bottom 0.254: v59.17,71.11 54.35,66.28 v50.54,66.28 | v41.39,65.27 41.14,65.01 41.14,54.85 v40.88,54.6
M3_INB  (via drill 0.2)
  Top 0.254: U$1.27 97.78,111.5 97.27,110.99 85.59,110.99 62.47,87.87 62.47,73.4 v59.17,70.09 | v41.14,52.06 M3-.A | v50.54,61.44 48.02,58.92 46.91,58.92 | R27.2 46.91,58.92 | v41.65,58.92 46.91,58.92
  Bottom 0.254: v59.17,70.09 59.17,70.07 v50.54,61.44 | v41.65,58.92 41.65,52.57 v41.14,52.06
M3_OUTA  (via drill 0.2)
  other vias: 41.01,71.62 41.52,71.62 41.01,71.11 41.52,71.11 40.38,67.55 39.61,66.79 40.38,66.79 41.14,66.79 41.14,67.55 41.14,68.32
  pour Top (no thermals): 40.88,68.82 39.11,67.05 39.11,65.27 40.12,65.27 41.65,66.79 41.65,75.94 40.88,75.94
  pour Bottom (no thermals): 39.11,67.05 40.88,68.82 40.88,71.87 41.65,71.87 41.65,66.79 40.12,65.27 39.11,65.27
M3_OUTB  (via drill 0.2)
  other vias: 34.66,71.62 35.17,71.62 34.66,71.11 35.17,71.11 35.04,68.32 35.04,67.55 35.04,66.79 35.8,67.55 35.8,66.79 36.57,66.79
  pour Top (no thermals): 35.3,75.94 35.3,68.82 37.07,67.05 37.07,65.27 36.06,65.27 34.53,66.79 34.53,75.94
  pour Bottom (no thermals): 36.06,65.27 34.53,66.79 34.53,71.87 35.3,71.87 35.3,68.82 37.07,67.05 37.07,65.27
M3_PWM  (via drill 0.2)
  Top 0.254: v14.47,62.47 R29.1
  Bottom 0.254: U$1.2 59.68,111.75 59.43,111.5 25.39,111.5 10.4,96.51 10.4,66.54 v14.47,62.47
M4_INA  (via drill 0.2)
  Top 0.254: U$1.28 100.32,110.99 99.81,110.48 85.84,110.48 62.98,87.62 62.98,72.89 v59.17,69.08 | v50.54,60.44 48.5,58.41 32.88,58.41 | v28.44,54.6 M4+.A | 32.88,58.41 v32.25,58.41 | R22.2 32.88,58.41
  Bottom 0.254: v59.17,69.08 v50.54,60.44 | v32.25,58.41 v28.44,54.6
M4_INB  (via drill 0.2)
  Top 0.254: U$1.29 102.86,110.48 102.35,109.97 86.1,109.97 63.49,87.37 63.49,72.38 v59.17,68.06 | v50.54,59.43 50.54,59.4 49.01,57.88 30.62,57.88 30.6,57.9 | M4-.A 29.96,52.06 30.6,52.7 30.6,57.9 | R23.2 30.6,57.9
  Bottom 0.254: v50.54,59.43 v59.17,68.06
M4_OUTA  (via drill 0.2)
  other vias: 28.31,71.62 28.82,71.62 28.82,71.11 28.31,71.11 27.68,67.55 26.91,66.79 27.68,66.79 28.44,66.79 28.44,67.55 28.44,68.32
  pour Top (no thermals): 28.18,68.82 26.41,67.05 26.41,65.27 27.42,65.27 28.95,66.79 28.95,75.94 28.18,75.94
  pour Bottom (no thermals): 26.41,67.05 28.18,68.82 28.18,71.87 28.95,71.87 28.95,66.79 27.42,65.27 26.41,65.27
M4_OUTB  (via drill 0.2)
  other vias: 22.47,71.62 21.96,71.62 21.96,71.11 22.47,71.11 22.34,68.32 22.34,67.55 22.34,66.79 23.1,67.55 23.1,66.79 23.87,66.79
  pour Top (no thermals): 22.6,75.94 22.6,68.82 24.37,67.05 24.37,65.27 23.36,65.27 21.83,66.79 21.83,75.94
  pour Bottom (no thermals): 21.83,71.87 22.6,71.87 22.6,68.82 24.37,67.05 24.37,65.27 23.36,65.27 21.83,66.79
M4_PWM  (via drill 0.2)
  Top 0.254: v14.47,65.01 R31.1
  Bottom 0.254: U$1.3/CANTX 62.22,111.75 61.46,110.99 25.64,110.99 10.91,96.26 10.91,68.57 v14.47,65.01
MISO
  Top 0.203: J_SPI.1 146.68,83.68 146.36,84 IC6.11
MOSI
  Top 0.203: J_SPI.4 147.94,81.27 146.17,81.27 144.24,83.2 IC6.10
MULTI_DIG1  (via drill 0.35)
  Top 0.254: v73.02,118.1 v67.3,118.1
  Bottom 0.254: U$1.31/A12 107.94,117.47 107.31,118.1 v73.02,118.1 | v67.3,118.1 30.47,118.1 9.39,97.02 9.39,58.92 23.1,45.2 33.77,45.2 34.55,44.42 MULTI1.3
MULTI_DIG2
  Bottom 0.254: U$1.34/A15 107.94,132.7 107.31,133.34 44.19,133.34 8.37,97.53 8.37,58.41 23.12,43.66 MULTI2.3
MULTI_PWM1  (via drill 0.35)
  Top 0.254: v72.38,117.47 v66.66,117.47
  Bottom 0.254: U$1.30 105.4,116.83 104.77,117.47 v72.38,117.47 | v66.66,117.47 30.6,117.47 9.9,96.76 9.9,59.17 23.36,45.71 35.8,45.71 36.55,44.96 MULTI1.2
MULTI_PWM2
  Bottom 0.254: U$1.35/A16 105.4,132.07 104.77,132.7 44.31,132.7 8.88,97.27 8.88,58.7 25.12,42.46 MULTI2.2
N$1
  Top 0.254: IC1.2 R3.2
N$2
  Top 0.254: IC1.6 R5.2 R4.2 C4.1
N$3
  Top 0.254: C3.1 94.32,36.69 95.59,37.96 IC1.5
N$4  (via drill 0.25)
  Top 0.254: v142.23,50.54 LD4.A
  Bottom 0.254: R18.2 v142.23,50.54
N$5
  Top 0.254: IC6.17 135.88,90.41 | 135.88,90.41 135.88,94.48 135.63,94.73 C17.1 | Q1.2 135.88,90.41
N$6
  Top 0.254: IC6.16 136.68,90.41 | 136.68,90.41 136.68,94.52 136.9,94.73 C16.1 | Q1.1 136.68,90.41
N$7
  Top 0.203: IC6.6 142.74,80 144.77,77.97 144.77,76.7 146.36,75.11 C18.1
N$8
  Top 0.203: IC6.3 143.11,77.6 143.5,77.21 143.5,69.59 144.52,68.57 R6.1
N$9
  Top 0.203: USB.2 150.42,66.73 148.9,66.73 148.26,67.37 R6.2
N$10
  Top 0.203: USB.3 150.87,67.3 149.85,68.32 149.85,70.86 149.6,71.11 R7.2
N$11
  Top 0.203: IC6.4 143.32,78.4 144.01,77.71 144.01,72.38 145.28,71.11 R7.1
N$12
  Top 0.203: IC6.7 142.74,80.8 144.81,78.73 150.1,78.73 154.74,74.09 154.74,73.08 153.66,65.78 153.22,65.46 USB.1
N$13
  Top 0.254: R10.2 34.28,107.94 | 34.28,107.94 34.28,105.91 34.79,105.4 M2-.C | M2+.C 34.28,107.94
N$14
  Top 0.254: M1-.C 22.09,105.4 21.58,105.91 21.58,107.94 | 21.58,107.94 R9.2 | M1+.C 21.58,107.94
N$15
  Top 0.254: M3+.C 34.28,54.6 33.96,54.28 33.96,52.06 | 33.96,52.06 R11.2 | M3-.C 33.96,52.06
N$16
  Top 0.254: M4+.C 21.58,54.6 21.26,54.28 21.26,52.06 | 21.26,52.06 R12.2 | M4-.C 21.26,52.06
N$17  (via drill 0.25)
  Top 0.254: v116.58,45.71 SW1L.C
  Bottom 0.254: R13.1 v116.58,45.71
N$18  (via drill 0.25)
  Top 0.254: v123.93,45.71 SW2L.C
  Bottom 0.254: R14.1 v123.93,45.71
N$19  (via drill 0.25)
  Top 0.254: SW3L.C v134.36,115.21
  Bottom 0.254: v134.36,115.21 R32.1
N$20  (via drill 0.25)
  Top 0.254: v130.8,50.54 LD1.A
  Bottom 0.254: R15.2 v130.8,50.54
N$21  (via drill 0.25)
  Top 0.254: v134.61,50.54 LD2.A
  Bottom 0.254: R16.2 v134.61,50.54
N$22  (via drill 0.25)
  Top 0.254: v138.42,50.54 LD3.A
  Bottom 0.254: R17.2 v138.42,50.54
N$23  (via drill 0.25)
  other vias: 128.26,84.06
N$24  (via drill 0.2)
  Top 0.203: v76.19,10.91 BAT.A
  Bottom 0.203: R33.2 v76.19,10.91
N$25  (via drill 0.2)
  Top 0.203: v68.82,10.91 MOT.A
  Bottom 0.203: R34.2 v68.82,10.91
N$26  (via drill 0.2)
  Top 0.203: v91.94,10.91 LD_ELECT.A
  Bottom 0.203: R35.1 v91.94,10.91
N_EST
  Top 0.254: LS_NORD.3 74,134.32 73.78,134.1 67.55,134.1 67.3,133.85 U$1.20/A6
N_INT
  Top 0.254: LS_NORD.2 72,134.87 71.75,134.61 65.01,134.61 64.76,134.36 U$1.21/A7
O_EST
  Top 0.254: LS_OVEST.3 60,136.07 62.22,133.85 U$1.22/A8
O_INT
  Top 0.254: LS_OVEST.2 58,136.04 59.68,134.36 U$1.23/A9
POWER_BLOCK_1
  Top 0.406: CB1.1 125.4,137.15 | 125.4,137.15 RB1.2 | 125.4,137.15 126.97,137.15 129.28,139.69 | S2.3 111.05,148.39 112,150.36 | 136.64,133.09 S3.3 | S4.3 150.5,106.54 152.64,107.43 | S5.3 157.47,77.46
  pour Top: 157.81,76.19 156.9,76.19 arc69 110.73,150.45 111.08,151.32 arc-70
POWER_BLOCK_2  (via drill 0.25, 0.35)
  Top 0.406: RB2.2 114.48,21.33 | 114.48,21.33 CB2.1 | v117.34,21.33 114.48,21.33 | S9.3 77.46,2.53 | S8.3 106.36,9.52 107.18,7.36 | S7.3 133.09,23.36 | 150.36,48 148.39,48.95 S6.3
  Bottom 0.406: v117.34,21.33 v122.93,15.74
  pour Top: 76.19,2.15 76.19,3.1 arc69 150.4,49.24 151.31,48.87 arc-70
POWER_BLOCK_3
  Top 0.406: RB3.2 43.49,16.5 | 43.49,16.5 CB3.1 | 43.49,16.5 42,16.5 40.12,13.45 | S13.3 2.53,82.54 | S12.3 9.58,53.64 7.61,52.82 | 23.36,26.91 23.34,26.93 S11.3 | S10.3 48.95,11.36 48,9.39
  pour Top: 2.32,83.81 3.26,83.81 arc69 49.45,9.51 49.09,8.61 arc-70
POWER_BLOCK_4  (via drill 0.25)
  Top 0.406: S1.3 82.54,156.96 88.13,156.96 88.89,156.2 v88.89,153.91 | S16.3 53.64,150.61 52.82,152.39 | S15.3 27.04,136.51 | S14.3 11.36,111.05 9.39,112
  Bottom 0.406: RB4.2 88.89,148.26 | 88.89,148.26 CB4.1 | 88.89,148.26 v88.89,153.91
  pour Top: 83.81,157.52 83.81,156.71 arc69 9.16,110.3 8.39,110.61 arc-70
PWM3  (via drill 0.2)
  Top 0.254: R29.2 21.33,62.47 22.34,63.49 v29.45,63.49 | v36.19,71.49 IC4.11
  Bottom 0.254: v36.19,71.49 35.3,72.38 33.26,72.38 33.01,72.13 33.01,66.03 30.47,63.49 v29.45,63.49
PWM_1  (via drill 0.2)
  Top 0.254: R28.2 42.79,101.46 41.9,102.35 35.55,102.35 v34.79,101.59 | v27.3,88.25 IC2.11
  Bottom 0.254: v34.79,101.59 30.47,97.27 30.47,87.87 30.22,87.62 27.68,87.62 27.3,88 v27.3,88.25
PWM_2  (via drill 0.2)
  Top 0.254: R30.2 42.79,99.18 40.12,101.84 36.06,101.84 v35.3,101.08 | v39.99,88.25 IC3.11
  Bottom 0.254: v35.3,101.08 33.01,98.8 33.01,87.87 33.26,87.62 39.36,87.62 v39.99,88.25
PWM_4  (via drill 0.2)
  Top 0.254: R31.2 21.33,65.01 22.34,64 29.96,64 v30.47,64.51 | v23.48,70.98 IC5.11
  Bottom 0.254: v30.47,64.51 30.47,72.13 30.22,72.38 24.88,72.38 v23.48,70.98
RST  (via drill 0.2)
  Top 0.254: IC6.13 139.08,87.26 139.75,87.93 145.15,87.93 | R8.1 145.08,87.86 145.15,87.93 | 145.15,87.93 147.18,87.93 RST.1 147.24,86.17 v147.31,86.1
  Bottom 0.254: J_SPI.5 147.56,77.46 147.94,77.84 147.94,85.46 v147.31,86.1
RX1
  Top 0.254: U$1.0/RX 54.6,119.12 46,127.72 BLUETOOTH.3
RX2  (via drill 0.2)
  Top 0.254: IC6.21 v132.68,87.11
  Bottom 0.254: U$1.9/CS 77.46,113.53 89.4,101.59 119.37,101.59 132.68,88.28 v132.68,87.11
RX3
  Bottom 0.254: U$2.P4 107.05,78.35 72.38,113.02 U$1.7
S_EST
  Top 0.254: U$1.14/A0 82.54,132.58 83.05,133.09 101.59,133.09 102,133.5 LS_SUD.3
S_INT
  Top 0.254: U$1.15/A1 80,133.09 80.51,133.59 99.56,133.59 100.07,134.1 100.07,136.93 LS_SUD.2
SCK
  Top 0.203: J_SPI.3 144.28,82.4 IC6.9
SCL  (via drill 0.35)
  Top 0.254: v76.7,78.73 R2.1
  Bottom 0.254: U$4.SCL 76.19,78.73 | 76.19,78.73 76.19,85.08 68.57,92.7 68.57,128.01 69.84,129.28 U$1.19/A5/SCL | 76.19,78.73 v76.7,78.73
SDA  (via drill 0.25)
  Top 0.254: v79.36,76.19 R1.1
  Bottom 0.254: U$4.SDA 78.73,76.19 | 78.73,76.19 78.73,83.81 71.11,91.43 71.11,128.01 72.38,129.28 U$1.18/A4/SDA | 78.73,76.19 v79.36,76.19
SP1
  Top 0.254: S1.1 77.46,153.41 77.97,152.9 100.07,152.9 126.48,126.48 126.48,81.78 126.66,81.6 IC6.26
SP2
  Top 0.254: S2.1 105.4,148.58 105.4,148.33 126.99,126.74 126.99,82.54 127.13,82.4 IC6.25
SP3
  Top 0.254: S3.1 127.5,131.09 127.5,88.64 128.26,87.87 133.85,87.87 134.28,87.44 IC6.19
SP4
  Top 0.254: IC6.18 135.08,87.66 134.36,88.38 128.77,88.38 128.01,89.14 128.01,97.78 128.51,98.29 134.74,98.29 146.66,110.22 146.66,110.28 S4.1
SP5  (via drill 0.25)
  Top 0.203: IC6.1 v142.88,76
  Bottom 0.203: S5.1 153.15,82.54 152.14,81.52 152.14,77.21 150.93,76 v142.88,76
SP6
  Top 0.254: IC6.40 136.68,72.85 146.8,62.73 146.8,56.12 148.58,54.35 S6.1
SP7
  Top 0.254: IC6.39 135.88,72.89 146.29,62.47 146.29,44.95 133.85,32.5 133.85,29.74 S7.1
SP8
  Top 0.254: IC6.38 135.08,72.93 145.79,62.22 145.79,45.2 113.02,12.44 S8.1
SP9
  Top 0.254: S9.1 82.54,6.59 83.3,7.36 100.07,7.36 106.16,13.45 113.27,13.45 145.28,45.46 145.28,61.97 134.28,72.96 IC6.37
SP10
  Top 0.254: IC6.36 133.48,73 144.77,61.71 144.77,45.71 113.02,13.96 105.91,13.96 99.81,7.86 57.9,7.86 S10.1
SP11
  Top 0.254: IC6.32 123.84,76.8 123.43,77.21 123.43,124.96 98.54,149.85 59.93,149.85 54.6,144.52 44.44,144.52 16.5,116.58 16.5,106.92 8.12,98.54 8.12,58.66 13.71,53.08 13.71,42.15 29.55,26.31 29.55,25.96 S11.1
SP12
  Top 0.254: S12.1 12.94,49.52 13.2,49.77 13.2,52.82 7.61,58.41 7.61,98.8 15.99,107.18 15.99,116.83 44.19,145.02 54.35,145.02 59.68,150.36 98.8,150.36 123.94,125.21 123.94,77.97 124.31,77.6 IC6.31
SP13
  Top 0.254: S13.1 6.85,77.46 7.1,77.71 7.1,99.05 15.48,107.43 15.48,117.08 43.93,145.53 54.09,145.53 59.43,150.87 99.05,150.87 124.45,125.47 124.45,78.73 124.78,78.4 IC6.30
SP14
  Top 0.254: S14.1 11.67,105.4 12.69,105.4 14.85,107.56 14.85,117.21 43.68,146.04 53.84,146.04 59.17,151.37 99.3,151.37 124.96,125.72 124.96,79.49 125.25,79.2 IC6.29
SP15
  Top 0.254: S15.1 26.37,130.04 26.91,130.04 43.42,146.55 53.58,146.55 58.92,151.88 99.56,151.88 125.47,125.97 125.47,80.25 125.72,80 IC6.28
SP16
  Top 0.254: S16.1 49.64,147.06 53.33,147.06 58.66,152.39 99.81,152.39 125.97,126.23 125.97,81.02 126.19,80.8 IC6.27
SW1  (via drill 0.3)
  Top 0.254: SW1.2 119.24,52.06 120,51.3 120,46.09 119.62,45.71 SW1L.A | v115.05,100.32 115.05,113.53 v103.11,125.47
  Bottom 0.254: SW1.2 115.56,52.06 114.29,53.33 114.29,60.95 117.08,63.74 117.08,98.29 v115.05,100.32 | v103.11,125.47 101.59,126.99 95.88,126.99 95.24,127.62 U$1.39/A20
SW2  (via drill 0.3)
  Top 0.254: v116.07,100.32 116.07,113.53 v104.13,125.47 | SW2.2 126.72,52.06 127.35,51.42 127.35,46.09 126.97,45.71 SW2L.A
  Bottom 0.254: SW2.2 122.91,52.06 121.64,53.33 121.64,59.95 117.85,63.74 117.85,98.54 v116.07,100.32 | U$1.38/A19 97.78,128.13 98.29,127.62 101.97,127.62 v104.13,125.47
SW3
  Top 0.254: SW3.2 137.15,121.56 137.78,120.92 137.78,115.59 137.4,115.21 SW3L.A
  Bottom 0.254: U$1.33/A14 121.56,130.8 130.8,121.56 SW3.2
TX1
  Top 0.254: BLUETOOTH.4 48,128.26 57.14,119.12 U$1.1/TX
TX2  (via drill 0.2)
  Top 0.254: IC6.20 v133.48,87.11
  Bottom 0.254: U$1.10/CS 80,111.75 89.65,102.1 119.62,102.1 133.48,88.24 v133.48,87.11
TX3
  Bottom 0.254: U$1.8 74.92,111.62 109.59,76.95 U$2.P5
V-  (via drill 0.25, 0.35)
  other vias: 43.93,90.67 46.73,90.67 43.93,89.65 46.73,89.65 43.93,88.64 46.73,88.64 45.33,90.67 45.33,89.65 45.33,88.64 43.93,71.36 43.93,70.35 43.93,69.33 45.33,71.36 45.33,70.35 45.33,69.33 16.75,71.36 19.55,71.36 16.75,70.35 19.55,70.35 16.75,69.33 19.55,69.33 18.15,71.36 18.15,70.35 18.15,69.33 16.75,90.67 19.55,90.67 16.75,89.65 19.55,89.65 16.75,88.64 19.55,88.64 18.15,90.67 18.15,89.65 18.15,88.64 30.98,85.84 32.5,85.84 30.98,85.08 32.5,85.08 30.98,84.32 32.5,84.32 30.98,75.68 32.5,75.68 30.98,74.92 32.5,74.92 30.98,74.16 32.5,74.16 43.93,72.38 45.33,72.38 31.74,75.68 31.74,74.92 31.74,74.16 31.74,85.84 31.74,85.08 31.74,84.32 68.57,43.17 69.84,43.17 71.11,43.17 72.38,43.17 73.65,43.17 74.92,43.17 76.19,43.17 68.57,41.9 69.84,41.9 71.11,41.9 72.38,41.9 73.65,41.9 74.92,41.9 76.19,41.9 68.57,40.63 69.84,40.63 71.11,40.63 72.38,40.63 73.65,40.63 74.92,40.63 76.19,40.63 68.57,39.36 69.84,39.36 71.11,39.36 72.38,39.36 73.65,39.36 74.92,39.36 76.19,39.36
  pour Top (no thermals): 42.15,91.05 42.15,84.06 42.92,84.06 44.19,85.33 47.49,85.33 50.79,88.64 60.95,88.64 60.95,91.05
  pour Top (no thermals): 29.45,91.18 34.03,91.18 34.03,84.06 29.45,84.06
  pour Top (no thermals): 29.45,75.94 34.03,75.94 34.03,68.82 29.45,68.82
  pour Top (no thermals): 42.15,75.94 42.92,75.94 44.19,74.67 45.96,74.67 45.96,68.82 42.15,68.82
  pour Top (no thermals): 21.33,91.18 21.33,84.06 20.56,84.06 19.29,85.33 15.48,85.33 13.45,87.37 11.93,87.37 11.93,91.18
  pour Top (no thermals): 21.33,75.94 21.33,68.82 14.47,68.82 13.96,69.33 13.96,72.89 12.06,74.79 12.06,78.48 13.71,78.48 17.52,74.67 19.29,74.67 20.56,75.94
  pour Bottom (no thermals): 51.55,25.26 49.9,26.91 49.9,33.41 51.79,35.3 58.66,35.3 60.19,36.82 60.19,37.84 58.66,39.36 51.54,39.36 49.9,40.99 49.9,44.84 51.79,46.73 58.66,46.73 60.19,48.25 60.19,49.27 58.66,50.79 51.54,50.79 49.9,52.42 49.9,87.75 50.79,88.64 60.95,88.64 60.95,91.05 42.15,91.05 42.15,84.06 41.39,83.3 34.79,83.3 34.03,84.06 34.03,86.1 29.45,86.1 29.45,84.06 28.69,83.3 22.09,83.3 21.33,84.06 21.33,91.18 11.93,91.18 11.93,68.82 21.33,68.82 21.33,75.94 22.09,76.7 28.69,76.7 29.45,75.94 29.45,73.9 34.03,73.9 34.03,75.94 34.79,76.7 41.27,76.7 42.15,75.81 42.15,25.64 47.11,20.69 51.55,25.14
  pour Top (no thermals): 67.94,34.28 76.83,34.28 76.83,45.08 67.94,45.08
  pour Bottom (no thermals): 56.38,46.73 51.81,46.73 49.9,44.82 49.9,41.01 51.55,39.36 58.66,39.36 60.44,37.58 62.47,37.58 62.98,38.09 66.03,38.09 67.81,36.31 76.7,36.31 76.7,44.95 68.06,44.95 67.3,44.19 58.92,44.19
  pour Bottom: 58.66,46.73 58.66,44.44 56.38,46.73
VBAT+  (via drill 0.35)
  Top 0.203: v99.81,18.53 99.81,16.5 v99.3,15.99
  Bottom 0.203: S_ELETTR..1 99.43,26.02 99.81,25.64 v99.81,18.53 | v99.3,15.99 97.53,14.21 84.83,14.21 81.52,10.91 R33.1
  pour Top (no thermals): 94.22,27.8 94.22,24.37 88.25,24.37 86.98,23.1 73.02,23.1 71.75,24.37 65.78,24.37 65.78,27.8
  pour Bottom (no thermals): 65.78,27.8 65.78,24.37 71.75,24.37 73.02,23.1 86.98,23.1 88.25,24.37 96.51,24.37 96.51,27.8
VMOT  (via drill 0.2, 0.25)
  Top 0.203: v46.73,20.06 46.73,21.07 51.55,25.9 54.09,25.9 v55.23,24.76
  Bottom 0.203: R34.1 55.87,10.91 v46.73,20.06
  other vias: 57.77,24.76 59.05,24.76 56.5,24.76 60.31,24.76 57.77,23.48 59.05,23.48 60.31,23.48 59.05,22.22 60.31,22.22 60.31,20.95 56.5,23.48 57.77,22.22 59.05,20.95
  pour Bottom (no thermals): 67.81,19.8 58.55,19.8 52.71,25.64 60.7,25.64 62.98,23.36 67.81,23.36
  pour Top (no thermals): 67.81,23.36 67.81,19.8 58.54,19.8 51.3,27.04 51.3,72.63 47.23,76.7 45.71,76.7 45.71,76.44 44.44,76.44 44.44,76.7 39.36,76.7 39.11,76.44 39.11,74.16 37.84,72.89 37.84,68.82 37.07,68.82 37.07,76.44 36.82,76.7 26.66,76.7 26.41,76.44 26.41,74.16 25.14,72.89 25.14,68.82 24.37,68.82 24.37,76.44 24.12,76.7 19.04,76.7 19.04,76.44 17.77,76.44 17.77,76.7 15.23,79.24 11.67,79.24 11.42,78.98 11.42,74.67 13.33,72.76 13.33,68.82 9.13,68.82 8.88,69.08 8.88,83.05 9.13,83.3 17.77,83.3 17.77,83.56 19.04,83.56 19.04,83.3 24.12,83.3 24.37,83.56 24.37,85.84 25.64,87.11 25.64,91.18 26.41,91.18 26.41,83.56 26.66,83.3 36.82,83.3 37.07,83.56 37.07,85.84 38.34,87.11 38.34,91.18 39.11,91.18 39.11,83.56 39.36,83.3 44.44,83.3 44.44,83.56 45.71,83.56 45.71,83.3 60.95,83.3 60.95,81.52 58.41,78.98 58.41,48 60.19,46.22 60.19,45.2 58.41,43.42 58.41,36.57 60.19,34.79 60.19,33.77 58.41,31.99 58.41,27.93 62.98,23.36
  pour Top (no thermals): 80.89,37.33 86.35,37.33 86.35,29.2 85.84,28.69 58.41,28.69 58.41,31.99 60.31,33.9 61.2,33.01 78.73,33.01 80.89,35.17
(copper drawn outside any net)
  shapes: Bottom circle x1, Top circle x1

## Text on the board
tNames: S1 | S2 | S16 | BLUETOOTH | BLUETOOTH | LS_OVEST | LS_NORD | LS_EST | LS_SUD | S3 | S15 | S4 | M1 | M2 | + | + | S14 | - | - | PALLA_PRESA | S5 | S13 | S6 | + | + | - | - | S12 | M4 | M3 | MULTI1 | MULTI2 | S7 | S11 | TOF | S8 | S10 | S9
bNames: Aco | Made with love by SPQR team: | DVDSPACCA | Designed by Dario Casagrande | EmaMaker | eooooooooooooooo | latino_deluxe | Morco | Siria | PALLA_PRESA | JLCJLCJLCJLC